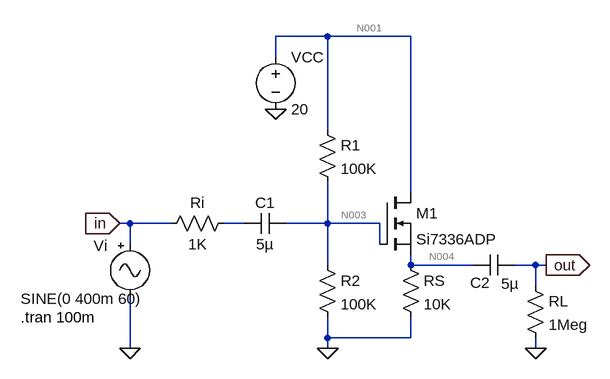
[diagram p0: schematic mosfet_cd_follower.asc]
mosfet_cd_follower.asc, the LTspice schematic file:
Version 4.1
SHEET 1 880 680
WIRE 400 -224 320 -224
WIRE 528 -224 400 -224
WIRE 320 -192 320 -224
WIRE 400 -80 400 -224
WIRE 528 16 528 -224
WIRE 96 64 80 64
WIRE 160 64 96 64
WIRE 272 64 240 64
WIRE 400 64 400 0
WIRE 400 64 336 64
WIRE 480 64 400 64
WIRE 96 96 96 64
WIRE 480 96 480 64
WIRE 400 128 400 64
WIRE 528 128 528 112
WIRE 624 128 528 128
WIRE 720 128 688 128
WIRE 736 128 720 128
WIRE 720 160 720 128
WIRE 400 240 400 208
WIRE 528 240 528 208
WIRE 528 240 400 240
WIRE 96 256 96 176
WIRE 400 256 400 240
WIRE 720 256 720 240
FLAG 320 -112 0
FLAG 400 256 0
FLAG 720 256 0
FLAG 96 256 0
FLAG 736 128 out
IOPIN 736 128 Out
FLAG 80 64 in
IOPIN 80 64 In
SYMBOL Misc\\signal 96 80 R0
WINDOW 0 -56 18 Left 2
WINDOW 3 -168 100 Left 2
WINDOW 123 0 0 Left 0
WINDOW 39 0 0 Left 0
SYMATTR InstName Vi
SYMATTR Value SINE(0 400m 60)
SYMBOL res 256 48 R90
WINDOW 0 0 56 VBottom 2
WINDOW 3 32 56 VTop 2
SYMATTR InstName Ri
SYMATTR Value 1K
SYMBOL cap 336 48 R90
WINDOW 0 0 32 VBottom 2
WINDOW 3 32 32 VTop 2
SYMATTR InstName C1
SYMATTR Value 5µ
SYMBOL voltage 320 -208 R0
WINDOW 123 0 0 Left 0
WINDOW 39 0 0 Left 0
SYMATTR InstName VCC
SYMATTR Value 20
SYMBOL res 512 112 R0
SYMATTR InstName RS
SYMATTR Value 10K
SYMBOL res 384 112 R0
SYMATTR InstName R2
SYMATTR Value 100K
SYMBOL res 384 -96 R0
SYMATTR InstName R1
SYMATTR Value 100K
SYMBOL cap 688 112 R90
WINDOW 0 59 53 VBottom 2
WINDOW 3 29 7 VTop 2
SYMATTR InstName C2
SYMATTR Value 5µ
SYMBOL res 704 144 R0
SYMATTR InstName RL
SYMATTR Value 1Meg
SYMBOL nmos 480 16 R0
SYMATTR InstName M1
SYMATTR Value Si7336ADP
TEXT -72 208 Left 2 !.tran 100m

The netlist it stands for:
* mosfet_cd_follower.asc
Vi in 0 SINE(0 400m 60)
Ri N002 in 1K
C1 N003 N002 5µ
VCC N001 0 20
RS N004 0 10K
R2 N003 0 100K
R1 N001 N003 100K
C2 out N004 5µ
RL out 0 1Meg
M1 N001 N003 N004 N004 Si7336ADP
.model NMOS NMOS
.model PMOS PMOS
.lib standard.mos
.tran 100m
.backanno
.end

* Results of the author's LTspice run, read from the files saved beside the schematic
* Operating Point, zero values left out:
*   V(n001) = 20 V
*   V(n003) = 10 V
*   V(n004) = 7.482 V
*   I(R1) = 100 µA
*   I(R2) = 100 µA
*   I(RS) = 748.2 µA
*   I(VCC) = -848.2 µA
*   Id(M1) = 748.2 µA
*   Is(M1) = -748.2 µA
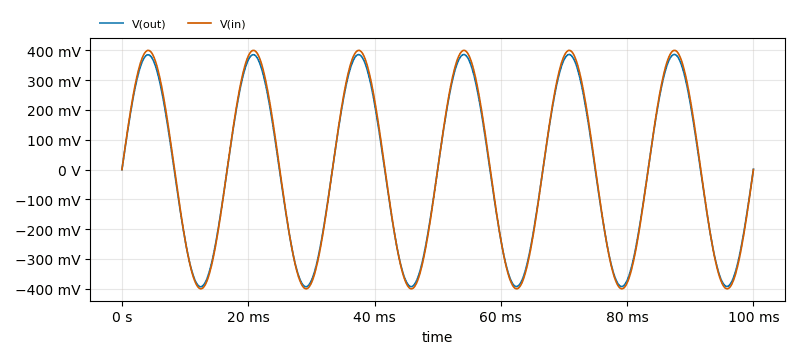
[diagram p1: Transient Analysis of mosfet_cd_follower.asc, plotted from the saved traces]
* Transient Analysis, 1 run:
*   V(out): min -393.2 mV, max 386.3 mV, average -3.484 mV, rms 275.2 mV, last 1.336 mV
*   V(in): min -400 mV, max 400 mV, average 0 V, rms 282.8 mV, last 0 V